# Altium schematic sheet USB-hub.SchDoc
size A3
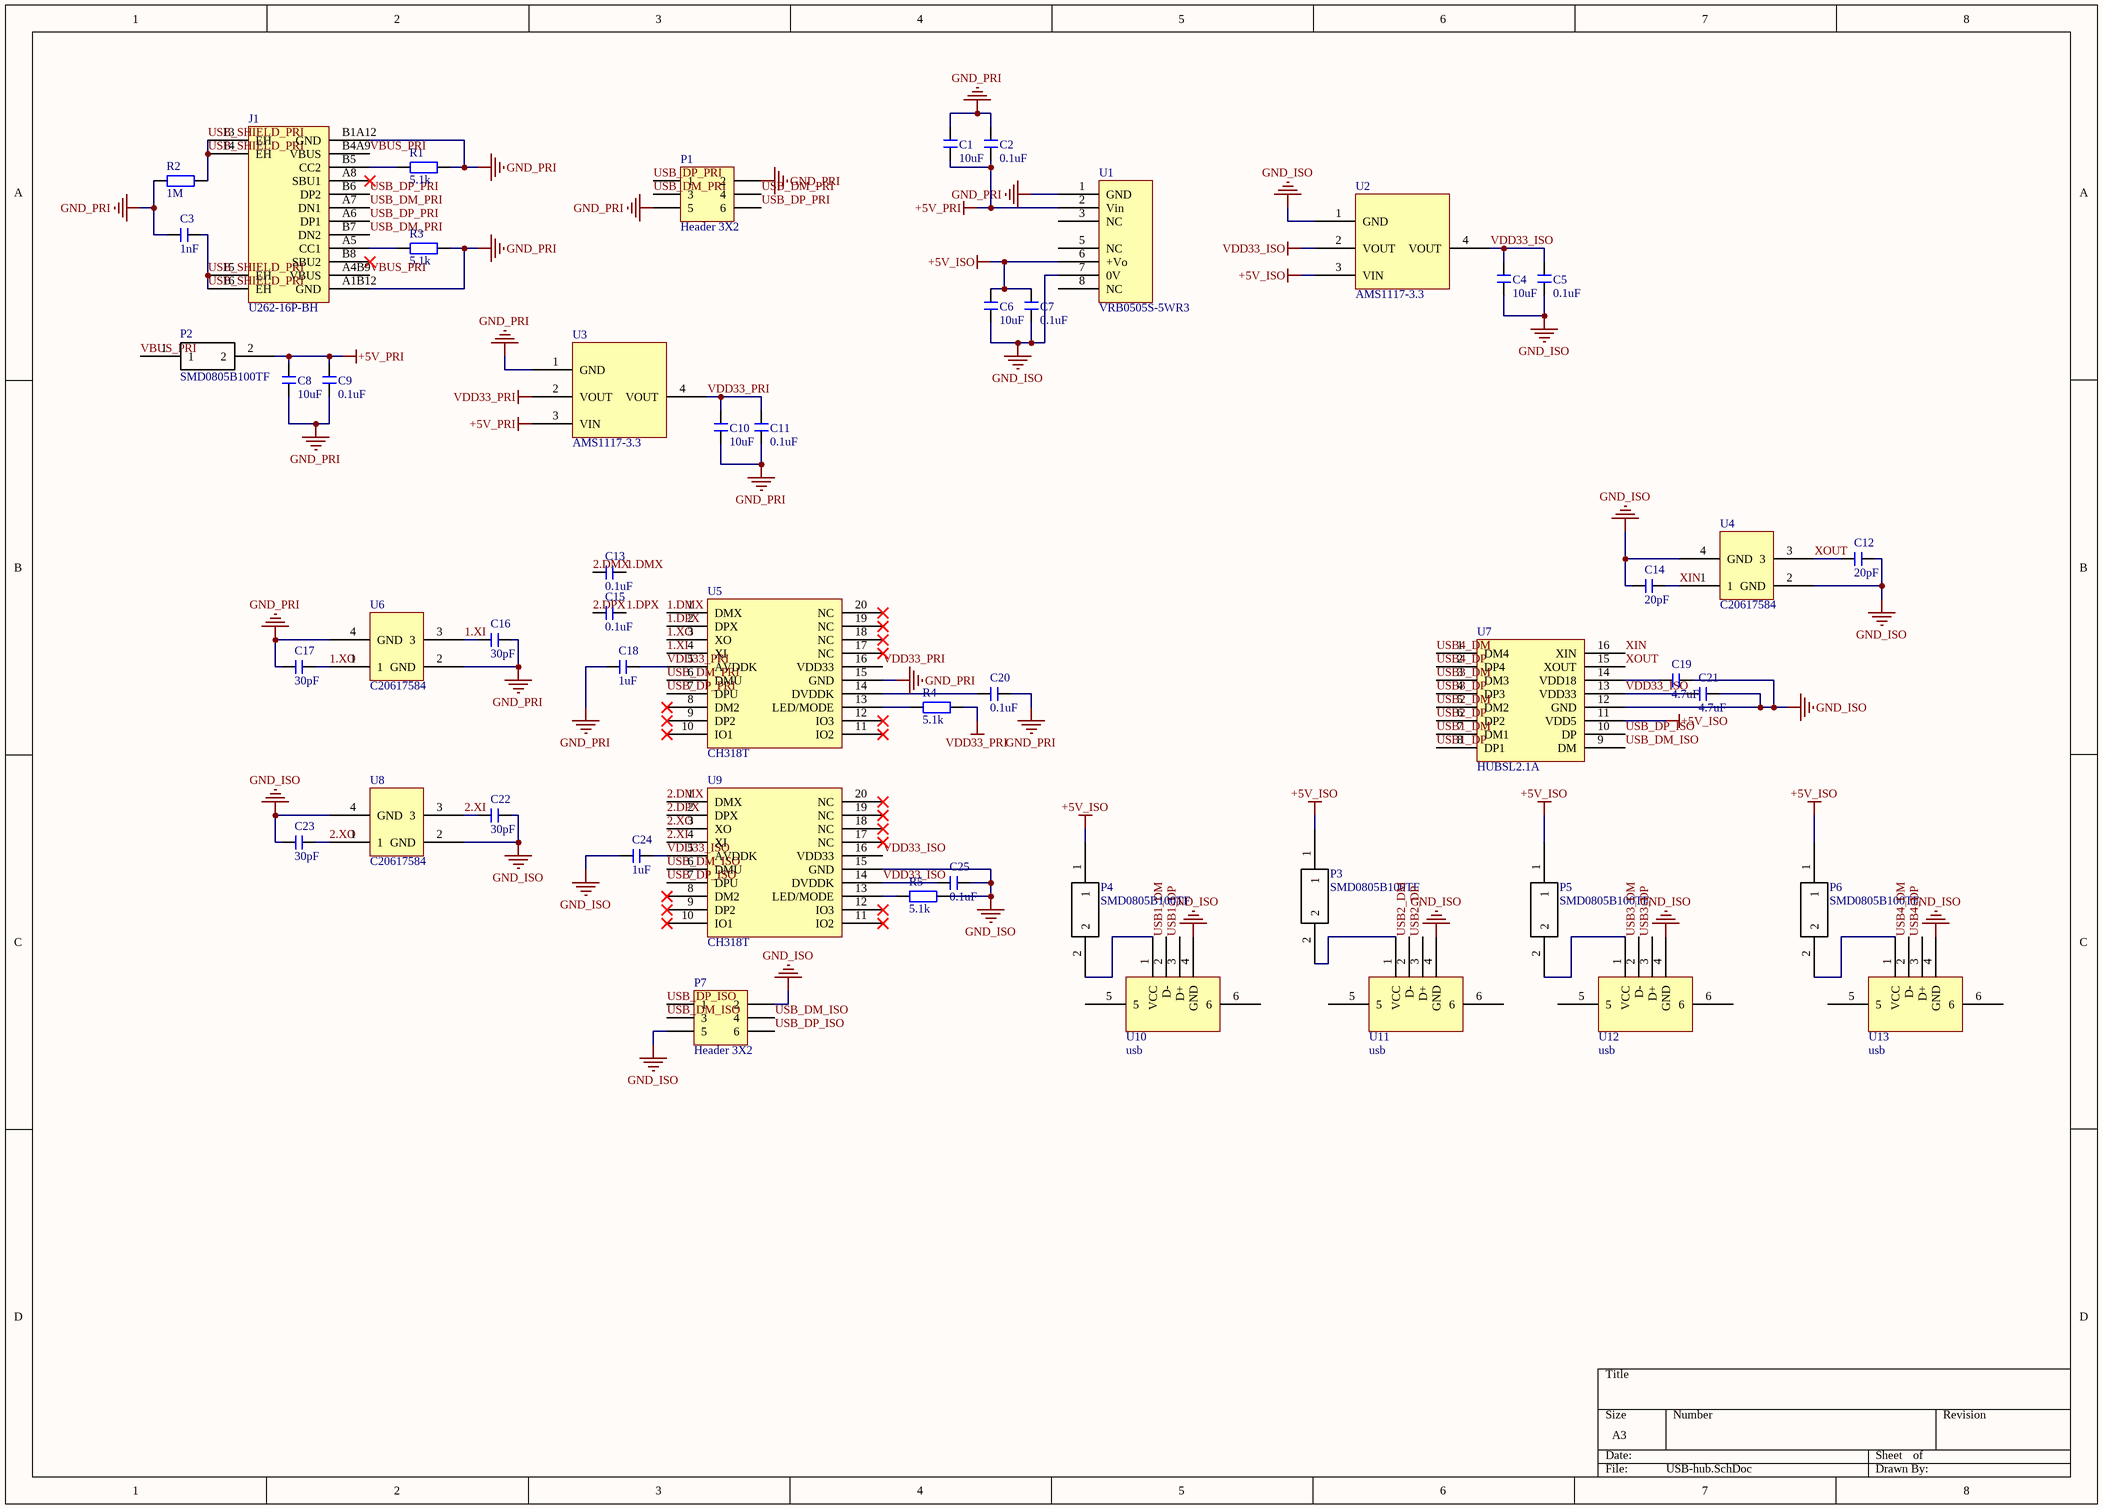
[diagram p0: USB-hub.SchDoc]

## Parts
C1  10uF  [C 0603_L]
C2  0.1uF  [C 0603_L]
C3  1nF  [C 0603_L]
C4  10uF  [C 0603_L]
C5  0.1uF  [C 0603_L]
C6  10uF  [C 0603_L]
C7  0.1uF  [C 0603_L]
C8  10uF  [C 0603_L]
C9  0.1uF  [C 0603_L]
C10  10uF  [C 0603_L]
C11  0.1uF  [C 0603_L]
C12  20pF  [C 0603_L]
C13  0.1uF  [C 0603_L]
C14  20pF  [C 0603_L]
C15  0.1uF  [C 0603_L]
C16  30pF  [C 0603_L]
C17  30pF  [C 0603_L]
C18  1uF  [C 0603_L]
C19  4.7uF  [C 0603_L]
C20  0.1uF  [C 0603_L]
C21  4.7uF  [C 0603_L]
C22  30pF  [C 0603_L]
C23  30pF  [C 0603_L]
C24  1uF  [C 0603_L]
C25  0.1uF  [C 0603_L]
J1  U262‑16P‑BH  [USB-hub]
P1  Header 3X2  [SOT-6]
P2  SMD0805B100TF  [SMD0805B100TF]
P3  SMD0805B100TF  [SMD0805B100TF]
P4  SMD0805B100TF  [SMD0805B100TF]
P5  SMD0805B100TF  [SMD0805B100TF]
P6  SMD0805B100TF  [SMD0805B100TF]
P7  Header 3X2  [SOT-6]
R1  5.1k  [R 0603_L]
R2  1M  [R 0603_L]
R3  5.1k  [R 0603_L]
R4  5.1k  [R 0603_L]
R5  5.1k  [R 0603_L]
U1  VRB0505S‑5WR3  [VRB0505S_5WR3]
U2  AMS1117-3.3  [AMS1117-3.3]
U3  AMS1117-3.3  [AMS1117-3.3]
U4  C20617584  [C20617584]
U5  CH318T  [CH318T]
U6  C20617584  [C20617584]
U7  HUBSL2.1A  [HUBSL2.1A]
U8  C20617584  [C20617584]
U9  CH318T  [CH318T]
U10  usb  [usb]
U11  usb  [usb]
U12  usb  [usb]
U13  usb  [usb]

## Nets
+5V_ISO: C6.2 C7.2 P3.1 P4.1 P5.1 P6.1 U1.6(+Vo) U2.3(VIN) U7.11(VDD5)
+5V_PRI: C1.1 C2.1 C8.1 C9.1 P2.2 U1.2(Vin) U3.3(VIN)
GND_ISO: C4.2 C5.2 C6.1 C7.1 C12.1 C14.2 C19.1 C21.1 C22.2 C23.2 C24.1 C25.2 P7.2 P7.5 R5.2 U1.7(0V) U2.1(GND) U4.2(GND) U4.4(GND) U7.12(GND) U8.2(GND) U8.4(GND) U9.15(GND) U10.4(GND) U11.4(GND) U12.4(GND) U13.4(GND)
GND_PRI: C1.2 C2.2 C3.1 C8.2 C9.2 C10.2 C11.2 C16.2 C17.2 C18.1 C20.2 J1.A1B12(GND) J1.B1A12(GND) P1.2 P1.5 R1.2 R2.1 R3.2 U1.1(GND) U3.1(GND) U5.15(GND) U6.2(GND) U6.4(GND)
VDD33_ISO: C4.1 C5.1 C21.2 C24.2 C25.1 U2.2(VOUT) U2.4(VOUT) U7.13(VDD33) U9.5(AVDDK) U9.14(DVDDK) U9.16(VDD33)
VDD33_PRI: C10.1 C11.1 C18.2 R4.2 U3.2(VOUT) U3.4(VOUT) U5.5(AVDDK) U5.16(VDD33)
1.DMX: C13.2 U5.1(DMX)
1.DPX: C15.2 U5.2(DPX)
1.XI: C16.1 U5.4(XI) U6.3
1.XO: C17.1 U5.3(XO) U6.1
2.DMX: C13.1 U9.1(DMX)
2.DPX: C15.1 U9.2(DPX)
2.XI: C22.1 U8.3 U9.4(XI)
2.XO: C23.1 U8.1 U9.3(XO)
USB1_DM: U7.7(DM1) U10.2(D-)
USB1_DP: U7.8(DP1) U10.3(D+)
USB2_DM: U7.5(DM2) U11.2(D-)
USB2_DP: U7.6(DP2) U11.3(D+)
USB3_DM: U7.3(DM3) U12.2(D-)
USB3_DP: U7.4(DP3) U12.3(D+)
USB4_DM: U7.1(DM4) U13.2(D-)
USB4_DP: U7.2(DP4) U13.3(D+)
USB_DM_ISO: P7.3 P7.4 U7.9(DM) U9.6(DMU)
USB_DM_PRI: J1.A7(DN1) J1.B7(DN2) P1.3 P1.4 U5.6(DMU)
USB_DP_ISO: P7.1 P7.6 U7.10(DP) U9.7(DPU)
USB_DP_PRI: J1.A6(DP1) J1.B6(DP2) P1.1 P1.6 U5.7(DPU)
USB_SHIELD_PRI: C3.2 J1.13(EH) J1.14(EH) J1.15(EH) J1.16(EH) R2.2
VBUS_PRI: J1.A4B9(VBUS) J1.B4A9(VBUS) P2.1
XIN: C14.1 U4.1 U7.16(XIN)
XOUT: C12.2 U4.3 U7.15(XOUT)
NetC19_2: C19.2 U7.14(VDD18)
NetC20_1: C20.1 U5.14(DVDDK)
NetJ1_A5: J1.A5(CC1) R3.1
NetJ1_B5: J1.B5(CC2) R1.1
NetP3_2: P3.2 U11.1(VCC)
NetP4_2: P4.2 U10.1(VCC)
NetP5_2: P5.2 U12.1(VCC)
NetP6_2: P6.2 U13.1(VCC)
NetR4_1: R4.1 U5.13(LED/MODE)
NetR5_1: R5.1 U9.13(LED/MODE)

Not connected (* = marked no-connect by the designer): J1 A8(SBU1)* B8(SBU2)*; U1 3(NC) 5(NC) 8(NC); U5 8(DM2)* 9(DP2)* 10(IO1)* 11(IO2)* 12(IO3)* 17(NC)* 18(NC)* 19(NC)* 20(NC)*; U9 8(DM2)* 9(DP2)* 10(IO1)* 11(IO2)* 12(IO3)* 17(NC)* 18(NC)* 19(NC)* 20(NC)*; U10 5 6; U11 5 6; U12 5 6; U13 5 6

## Library data of the parts
C1-C25 = C: 贴片电容; BOM名称: 无极性贴片电容; 淘宝ID: 封装库来自淘宝 ID：黄晶宝石; 联系售后: https://shop463601444.taobao.com
J1 = type_c
P1 P7 = Header 3X2: Header, 3-Pin, Dual row; LatestRevisionDate: 17-Jul-2002; LatestRevisionNote: Re-released for DXP Platform.; Publisher: Altium Limited
R1-R5 = R: 贴片电阻; 版权归属: 来自淘宝 ID：黄晶宝石; BOM名称: 贴片电阻; 联系售后: https://shop463601444.taobao.com